# EAGLE design RK (EAGLE 7.2.0)
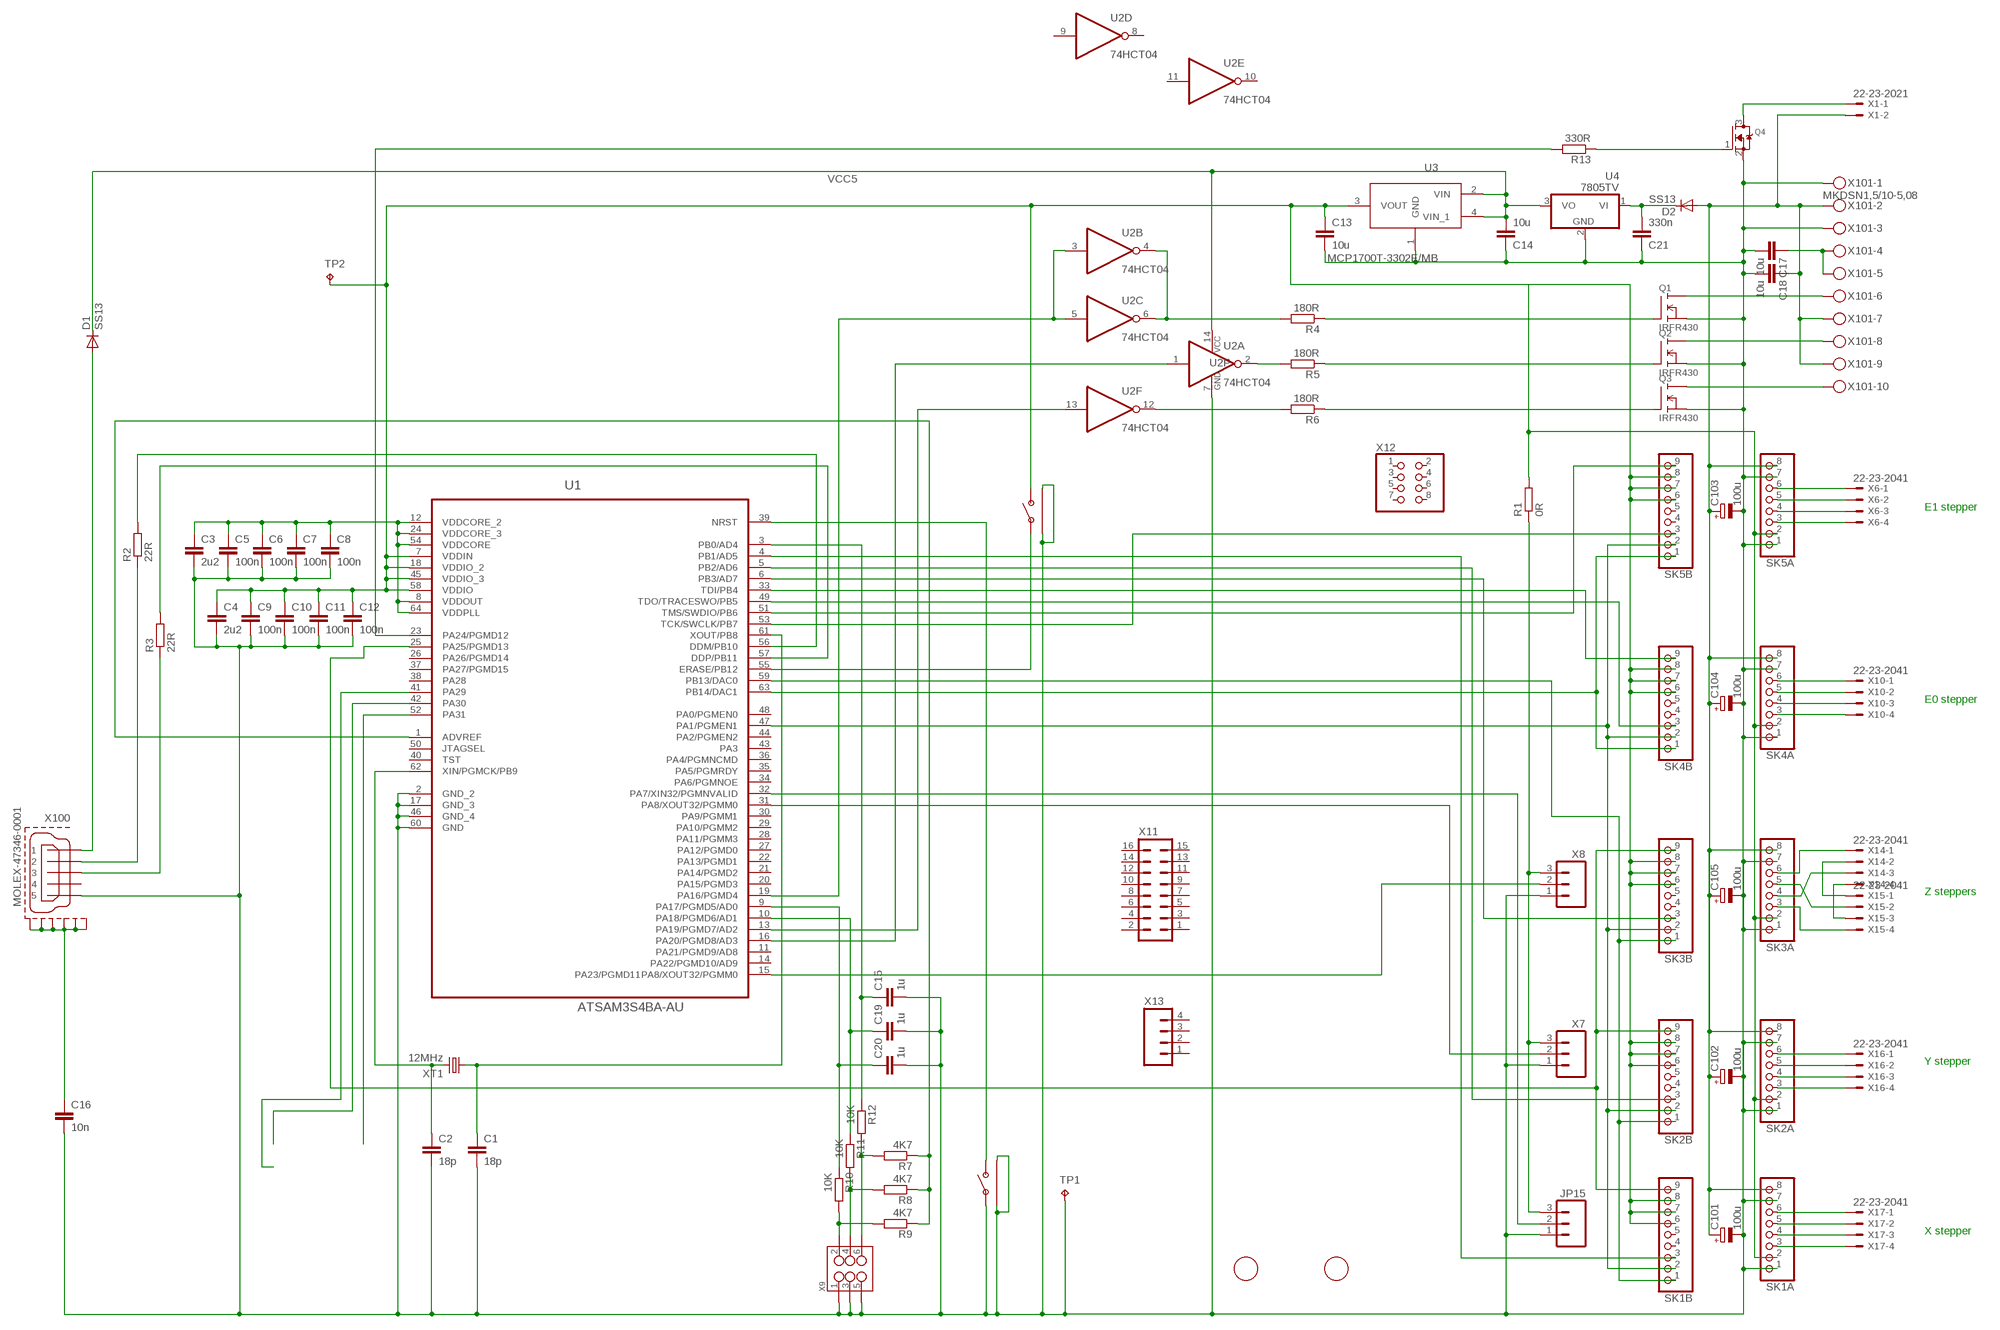
[diagram p0: schematic, sheet 1]

## Parts
C1  18p  C-EUC0603  [C0603]
C2  18p  C-EUC0603  [C0603]
C3  2u2  C-EUC0603  [C0603]
C4  2u2  C-EUC0603  [C0603]
C5  100n  C-EUC0603  [C0603]
C6  100n  C-EUC0603  [C0603]
C7  100n  C-EUC0603  [C0603]
C8  100n  C-EUC0603  [C0603]
C9  100n  C-EUC0603  [C0603]
C10  100n  C-EUC0603  [C0603]
C11  100n  C-EUC0603  [C0603]
C12  100n  C-EUC0603  [C0603]
C13  10u  C-EUC0805  [C0805]
C14  10u  C-EUC0805  [C0805]
C15  1u  C-EUC0603  [C0603]
C16  10n  C-EUC0603  [C0603]
C17  10u  C-EUC0805K  [C0805K]
C18  10u  C-EUC0805K  [C0805K]
C19  1u  C-EUC0603  [C0603]
C20  1u  C-EUC0603  [C0603]
C21  330n  C-EUC0805  [C0805]
C101  100u  CPOL-EUD  [PANASONIC_D]
C102  100u  CPOL-EUD  [PANASONIC_D]
C103  100u  CPOL-EUD  [PANASONIC_D]
C104  100u  CPOL-EUD  [PANASONIC_D]
C105  100u  CPOL-EUD  [PANASONIC_D]
D1  SS13  DIODE-DO214AC  [DO214AC]
D2  SS13  DIODE-DO214AC  [DO214AC]
JP15  M03PTH  [1X03]
Q1  IRFR430  [DPAK]
Q2  IRFR430  [DPAK]
Q3  IRFR430  [DPAK]
Q4  MOSFET-NREFLOW  [SOT23]
R1  0R  R-EU_R0603  [R0603]
R2  22R  R-EU_R0603  [R0603]
R3  22R  R-EU_R0603  [R0603]
R4  180R  R-EU_R0603  [R0603]
R5  180R  R-EU_R0603  [R0603]
R6  180R  R-EU_R0603  [R0603]
R7  4K7  R-EU_R0603  [R0603]
R8  4K7  R-EU_R0603  [R0603]
R9  4K7  R-EU_R0603  [R0603]
R10  10K  R-EU_R0603  [R0603]
R11  10K  R-EU_R0603  [R0603]
R12  10K  R-EU_R0603  [R0603]
R13  330R  R-EU_R0603  [R0603]
SK1A  PINHD-1X8BIG  [1X08-BIG]
SK1B  PINHD-1X9  [1X09-BIG]
SK2A  PINHD-1X8BIG  [1X08-BIG]
SK2B  PINHD-1X9  [1X09-BIG]
SK3A  PINHD-1X8BIG  [1X08-BIG]
SK3B  PINHD-1X9  [1X09-BIG]
SK4A  PINHD-1X8BIG  [1X08-BIG]
SK4B  PINHD-1X9  [1X09-BIG]
SK5A  PINHD-1X8BIG  [1X08-BIG]
SK5B  PINHD-1X9  [1X09-BIG]
TP1  TPPAD1-10  [P1-10]
TP2  TPPAD1-10  [P1-10]
U1  ATSAM3S4BA-AU  [QFP50P1200X1200X160-64N]
U2  74HCT04  7404  [TSSOP14]
U3  MCP1700T-3302E/MB  MCP17-MCP1702T-3302E/MB  [SOT150P400X160-4N]
U4  7805TV  [TO220V]
U$1  FIDUCIAL  [FIDUCIAL_1MM]
U$2  FIDUCIAL  [FIDUCIAL_1MM]
U$3  ALPS-SKHHLUA010  [SKHHLUA010]
U$4  ALPS-SKHHLUA010  [SKHHLUA010]
X1  22-23-2021  [22-23-2021]
X6  22-23-2041  [22-23-2041]
X7  M03PTH  [1X03]
X8  M03PTH  [1X03]
X9  M03X22X3_SILK_SM  [2X3]
X10  22-23-2041  [22-23-2041]
X11  MA08-2  [MA08-2]
X12  PINHD-2X4  [2X04]
X13  M04PTH  [1X04]
X14  22-23-2041  [22-23-2041]
X15  22-23-2041  [22-23-2041]
X16  22-23-2041  [22-23-2041]
X17  22-23-2041  [22-23-2041]
X100  MOLEX-47346-0001  [MOLEX-47364-0001]
X101  MKDSN1,5/10-5,08  [MKDSN1,5/10-5,08]
XT1  12MHz  CRYSTALHC49U-V  [HC49U-V]

## Nets
BED-VE: Q1.2(D) X101.6
GND: C1.2 C2.2 C3.2 C4.2 C5.2 C6.2 C7.2 C8.2 C9.2 C10.2 C11.2 C12.2 C13.2 C14.1 C15.2 C16.2 C17.2 C18.2 C19.2 C20.2 C21.1 C101.- C102.- C103.- C104.- C105.- JP15.1 Q1.3(S) Q2.3(S) Q3.3(S) Q4.2(S) SK1A.1 SK1A.7 SK2A.1 SK2A.7 SK3A.1 SK3A.7 SK4A.1 SK4A.7 SK5A.1 SK5A.7 TP1.TP U1.2(GND_2) U1.17(GND_3) U1.46(GND_4) U1.60(GND) U2.7(P:GND) U3.1(GND) U4.2(GND) U$3.P$1 U$3.P$3 U$3.P$4 U$4.P$3 U$4.P$4 X7.1 X8.1 X9.1 X9.3 X9.5 X100.5 X101.1 X101.3
HEATER1-VE: Q2.2(D) X101.8
HEATER2-VE: Q3.2(D) X101.10
N$1: SK1B.2 SK2B.2 SK3B.2 SK4B.2 SK5B.2 U1.47(PA1/PGMEN1)
N$2: SK4A.3 X10.4
N$3: SK4A.4 X10.3
N$4: SK4A.5 X10.2
N$5: SK4A.6 X10.1
N$6: SK1A.3 X17.4
N$7: SK1A.4 X17.3
N$8: SK1A.5 X17.2
N$9: SK1A.6 X17.1
N$10: SK3A.6 X14.1
N$11: SK3A.4 X14.3
N$12: SK3A.3 X15.4
N$13: X14.2 X15.1
N$14: X14.4 X15.3
N$15: SK3A.5 X15.2
N$16: C18.1 C101.+ C102.+ C103.+ C104.+ C105.+ D2.A SK1A.8 SK2A.8 SK3A.8 SK4A.8 SK5A.8 X1.2 X101.2 X101.7 X101.9
N$17: SK5A.3 X6.4
N$18: R2.2 U1.56(DDM/PB10)
N$19: SK5A.4 X6.3
N$20: SK5A.5 X6.2
N$21: C1.1 U1.61(XOUT/PB8) XT1.1
N$22: C2.1 U1.62(XIN/PGMCK/PB9) XT1.2
N$23: U1.55(ERASE/PB12) U$4.P$1
N$24: U1.41(PA29)
N$25: U1.39(NRST) U$3.P$2
N$26: SK1B.3 U1.4(PB1/AD5)
N$27: C20.1 R10.1 U1.9(PA17/PGMD5/AD0)
N$28: R3.2 U1.57(DDP/PB11)
N$29: U1.19(PA16/PGMD4) U2.3(B:I) U2.5(C:I)
N$30: U1.13(PA19/PGMD7/AD2) U2.13(F:I)
N$31: D1.A X100.1
N$32: R2.1 X100.2
N$33: R7.2 R12.2 X9.6
N$34: R3.1 X100.3
N$35: R13.2 U1.23(PA24/PGMD12)
N$36: SK5A.6 X6.1
N$37: SK2A.3 X16.4
N$38: SK2A.4 X16.3
N$39: SK2A.5 X16.2
N$40: SK1B.9 SK2B.9 SK3B.9 U1.25(PA25/PGMD13)
N$41: U1.42(PA30)
N$42: U1.52(PA31)
N$43: SK2A.6 X16.1
N$44: SK5B.3 U1.53(TCK/SWCLK/PB7)
N$45: JP15.3 R1.1 X7.3 X8.3
N$47: C16.1 X100.GND1 X100.GND2 X100.GND3 X100.GND4 X100.GND5 X100.GND6
N$48: SK4B.9 U1.33(TDI/PB4)
N$49: C17.1 X101.4 X101.5
N$50: C19.1 R11.1 U1.10(PA18/PGMD6/AD1)
N$51: SK4B.1 SK5B.1 U1.63(PB14/DAC1)
N$52: SK1B.1 SK2B.1 SK3B.1 U1.59(PB13/DAC0)
N$53: R7.1 R8.1 R9.1 U1.1(ADVREF)
N$54: SK4B.3 U1.49(TDO/TRACESWO/PB5)
N$55: R8.2 R11.2 X9.4
N$56: SK5B.9 U1.51(TMS/SWDIO/PB6)
N$57: SK3B.3 U1.6(PB3/AD7)
N$58: SK2B.3 U1.5(PB2/AD6)
N$59: U1.15(PA23/PGMD11PA8/XOUT32/PGMM0) X8.2
N$60: Q4.3(D) X1.1
N$62: U1.31(PA8/XOUT32/PGMM0) X7.2
N$63: Q4.1(G) R13.1
N$65: Q1.1(G) R4.1
N$66: Q2.1(G) R5.1
N$67: Q3.1(G) R6.1
N$68: R9.2 R10.2 X9.2
N$69: C15.1 R12.1 U1.3(PB0/AD4)
N$70: U1.16(PA20/PGMD8/AD3) U2.1(A:I)
N$71: R6.2 U2.12(F:O)
N$72: R4.2 U2.4(B:O) U2.6(C:O)
N$73: R5.2 U2.2(A:O)
N$78: C21.2 D2.C U4.1(VI)
VCC: C4.1 C9.1 C10.1 C11.1 C12.1 C13.1 R1.2 SK1A.2 SK1B.6 SK1B.7 SK1B.8 SK2A.2 SK2B.6 SK2B.7 SK2B.8 SK3A.2 SK3B.6 SK3B.7 SK3B.8 SK4A.2 SK4B.6 SK4B.7 SK4B.8 SK5A.2 SK5B.6 SK5B.7 SK5B.8 TP2.TP U1.7(VDDIN) U1.18(VDDIO_2) U1.45(VDDIO_3) U1.58(VDDIO) U3.3(VOUT) U$4.P$2
VCC5: C14.2 D1.C U2.14(P:VCC) U3.2(VIN) U3.4(VIN_1) U4.3(VO)
VDDCORE: C3.1 C5.1 C6.1 C7.1 C8.1 U1.8(VDDOUT) U1.12(VDDCORE_2) U1.24(VDDCORE_3) U1.54(VDDCORE) U1.64(VDDPLL)
X6: JP15.2 U1.32(PA7/XIN32/PGMNVALID)
Unconnected: SK1B.4 SK1B.5 SK2B.4 SK2B.5 SK3B.4 SK3B.5 SK4B.4 SK4B.5 SK5B.4 SK5B.5 U1.11(PA21/PGMD9/AD8) U1.14(PA22/PGMD10/AD9) U1.20(PA15/PGMD3) U1.21(PA14/PGMD2) U1.22(PA13/PGMD1) U1.26(PA26/PGMD14) U1.27(PA12/PGMD0) U1.28(PA11/PGMM3) U1.29(PA10/PGMM2) U1.30(PA9/PGMM1) U1.34(PA6/PGMNOE) U1.35(PA5/PGMRDY) U1.36(PA4/PGMNCMD) U1.37(PA27/PGMD15) U1.38(PA28) U1.40(TST) U1.43(PA3) U1.44(PA2/PGMEN2) U1.48(PA0/PGMEN0) U1.50(JTAGSEL) U2.8(D:O) U2.9(D:I) U2.10(E:O) U2.11(E:I) X11.1 X11.2 X11.3 X11.4 X11.5 X11.6 X11.7 X11.8 X11.9 X11.10 X11.11 X11.12 X11.13 X11.14 X11.15 X11.16 X12.1 X12.2 X12.3 X12.4 X12.5 X12.6 X12.7 X12.8 X13.1 X13.2 X13.3 X13.4 X100.4

## Notes on the sheet
- E1 stepper
- E0 stepper
- Z steppers
- Y stepper
- X stepper

## Library data of the parts
C1-C21 = resistor:C-EU: CAPACITOR, European symbol
C101-C105 = resistor:CPOL-EU: POLARIZED CAPACITOR, European symbol
D1 D2 = diode:DIODE-: DIODE
JP15 X7 X8 = SparkFun-Connectors:M03: Header 3 Standard 3-pin 0.1" header. Use with straight break away headers (SKU : PRT-00116), right angle break away headers (PRT-00553), swiss pins (PRT-00743), machine pins (PRT-00117), and female headers (PRT-00115). Molex polarized connector foot print use with SKU : PRT-08232 with associated crimp pins and housings.
Q1-Q3 = transistor-fet:IRFR430: N-Channel HEXFET
Q4 = adafruit:MOSFET-N: N-Channel Mosfet 2N7002E - 60V 260mA SOT23 [Digikey: 2N7002ET1GOSTR-ND] - REEL BSH103 - 30V 850mA SOT23 [Digikey: 568-5013-1-ND]
R1-R13 = resistor:R-EU_: RESISTOR, European symbol
SK1A SK2A SK3A SK4A SK5A = adafruit:PINHD-1X8: PIN HEADER
SK1B SK2B SK3B SK4B SK5B = adafruit:PINHD-1X9: Pin header 1x10 0.1" spacing With round pins
TP1 TP2 = testpad:TP: Test pad
U1 = Atmel_By_element14_Batch_1:ATSAM3S4BA-AU: Flash MCU; DESCRIPTION: Flash MCU; MPN: ATSAM3S4BA-AU; OC_FARNELL: 1841656; OC_NEWARK: 12T1314; PACKAGE: QFP-64; SUPPLIER: Atmel
U2 = eschertechnologies:74*04: Hex INVERTER
U3 = Microchip-MCP170xxxx_MB:MCP17: Low Quiescent Current LDO Regulator; MPN: MCP1702T-3302E/MB; OC_FARNELL: 1605558; OC_NEWARK: 11N7989; PACKAGE: SOT89-3; SUPPLIER: Microchip
U4 = linear:78*: Positive VOLTAGE REGULATOR Source: http://cache.national.com/ds/LM/LM78L05.pdf http://www.fairchildsemi.com/ds/LM/LM7805.pdf
U$1 U$2 = adafruit:FIDUCIAL: For use by pick and place machines to calibrate the vision/machine, 1mm By microbuilder.eu
U$3 U$4 = eschertechnologies:ALPS-SKHHLUA010
X1 = con-molex:22-23-2021: .100" (2.54mm) Center Header - 2 Pin; MF: MOLEX; MPN: 22-23-2021; OC_FARNELL: 1462926; OC_NEWARK: 25C3832
X6 X10 X14-X17 = con-molex:22-23-2041: .100" (2.54mm) Center Header - 4 Pin; MF: MOLEX; MPN: 22-23-2041; OC_FARNELL: 1462920; OC_NEWARK: 38C0355
X9 = SparkFun-Connectors:M03X2: 2x3 .1" header. Shrouded, with keying- CONN-10681 SMT- CONN-11415 Pogo pins- HW-11044
X11 = con-lstb:MA08-2: PIN HEADER; OC_FARNELL: unknown; OC_NEWARK: unknown
X12 = adafruit:PINHD-2X4: PIN HEADER
X13 = SparkFun-Connectors:M04: Header 4 Standard 4-pin 0.1" header. Use with straight break away headers (SKU : PRT-00116), right angle break away headers (PRT-00553), swiss pins (PRT-00743), machine pins (PRT-00117), and female headers (PRT-00115). Molex polarized connector foot print use with SKU : PRT-08231 with associated crimp pins and housings. 1MM SMD Version SKU: PRT-10208
X100 = usb_con-update:MOLEX-47346-0001: MICRO USB B, BOTTOM MOUNT
X101 = con-phoenix-508:MKDSN1,5/10-5,08: MKDSN 1,5/10-5,08 Printklemme Nennstrom: 13,5 A Nennspannung: 250 V Rastermaß: 5,08 mm Polzahl: 10 Anschlussart: Schraubanschluss Montage: Löten Anschlussrichtung Leiter/Platine: 0 ° Artikelnummer: 1729209 Source: http://eshop.phoenixcontact.com .. 1729209.pdf; MPN: SMKDSN1,5/10-5,08; OC_FARNELL: 1792913; OC_NEWARK: 70R0297
XT1 = crystal:CRYSTAL: CRYSTAL; OC_FARNELL: 1666969; OC_NEWARK: unknown

## Board
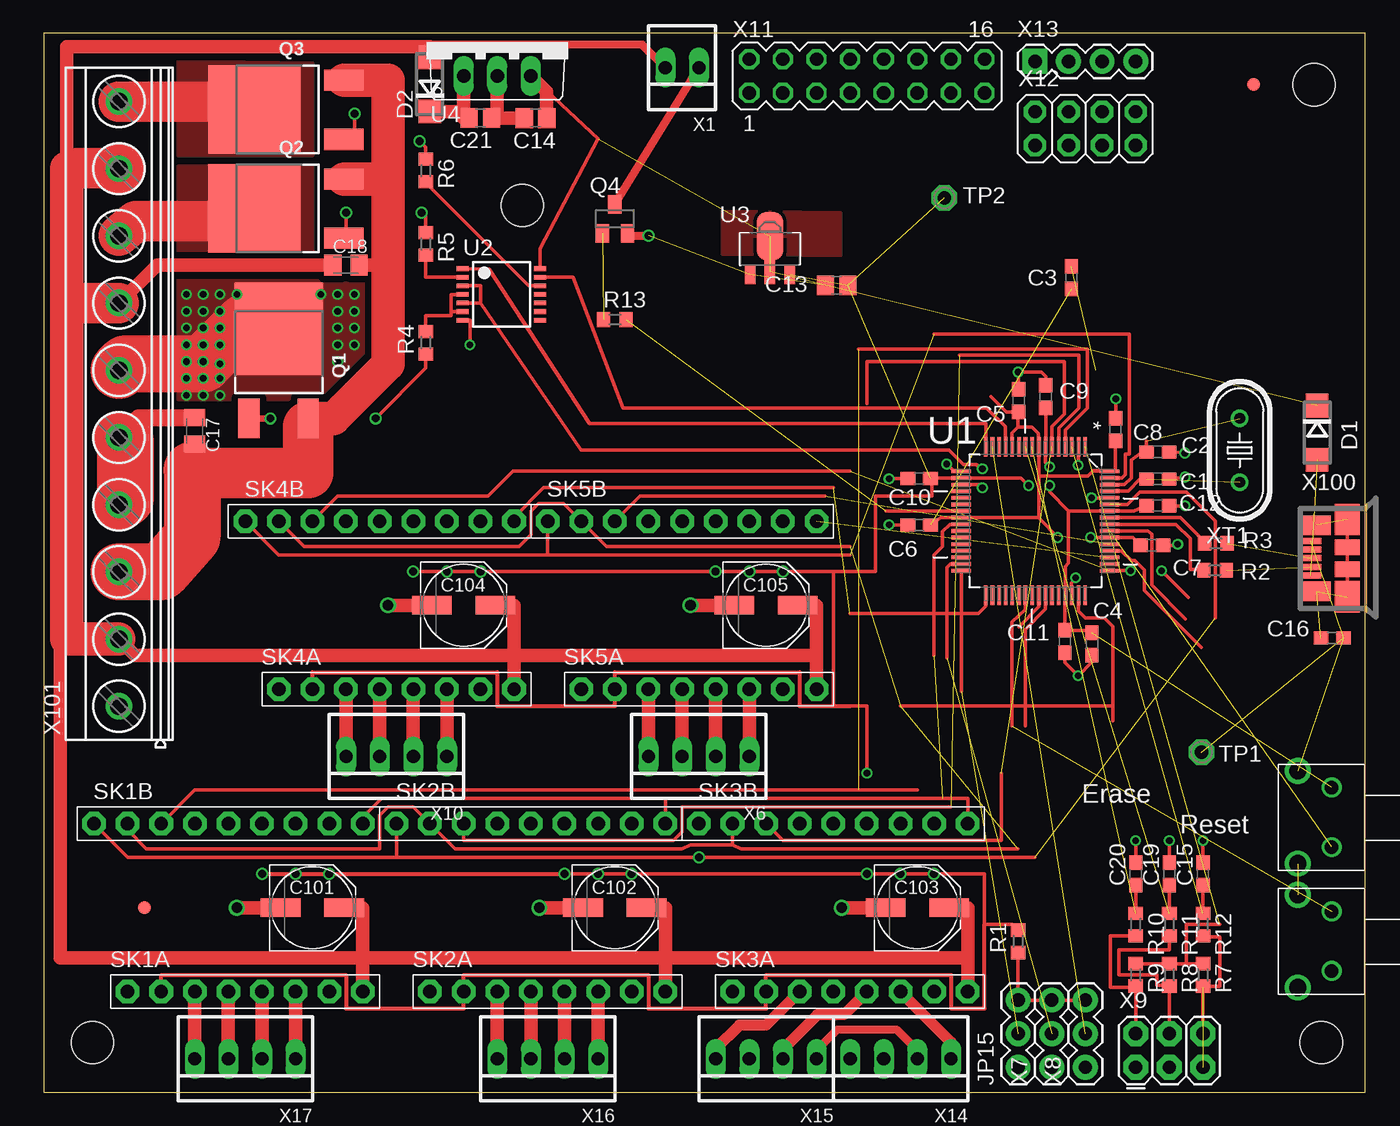
[diagram p1: board, top side]
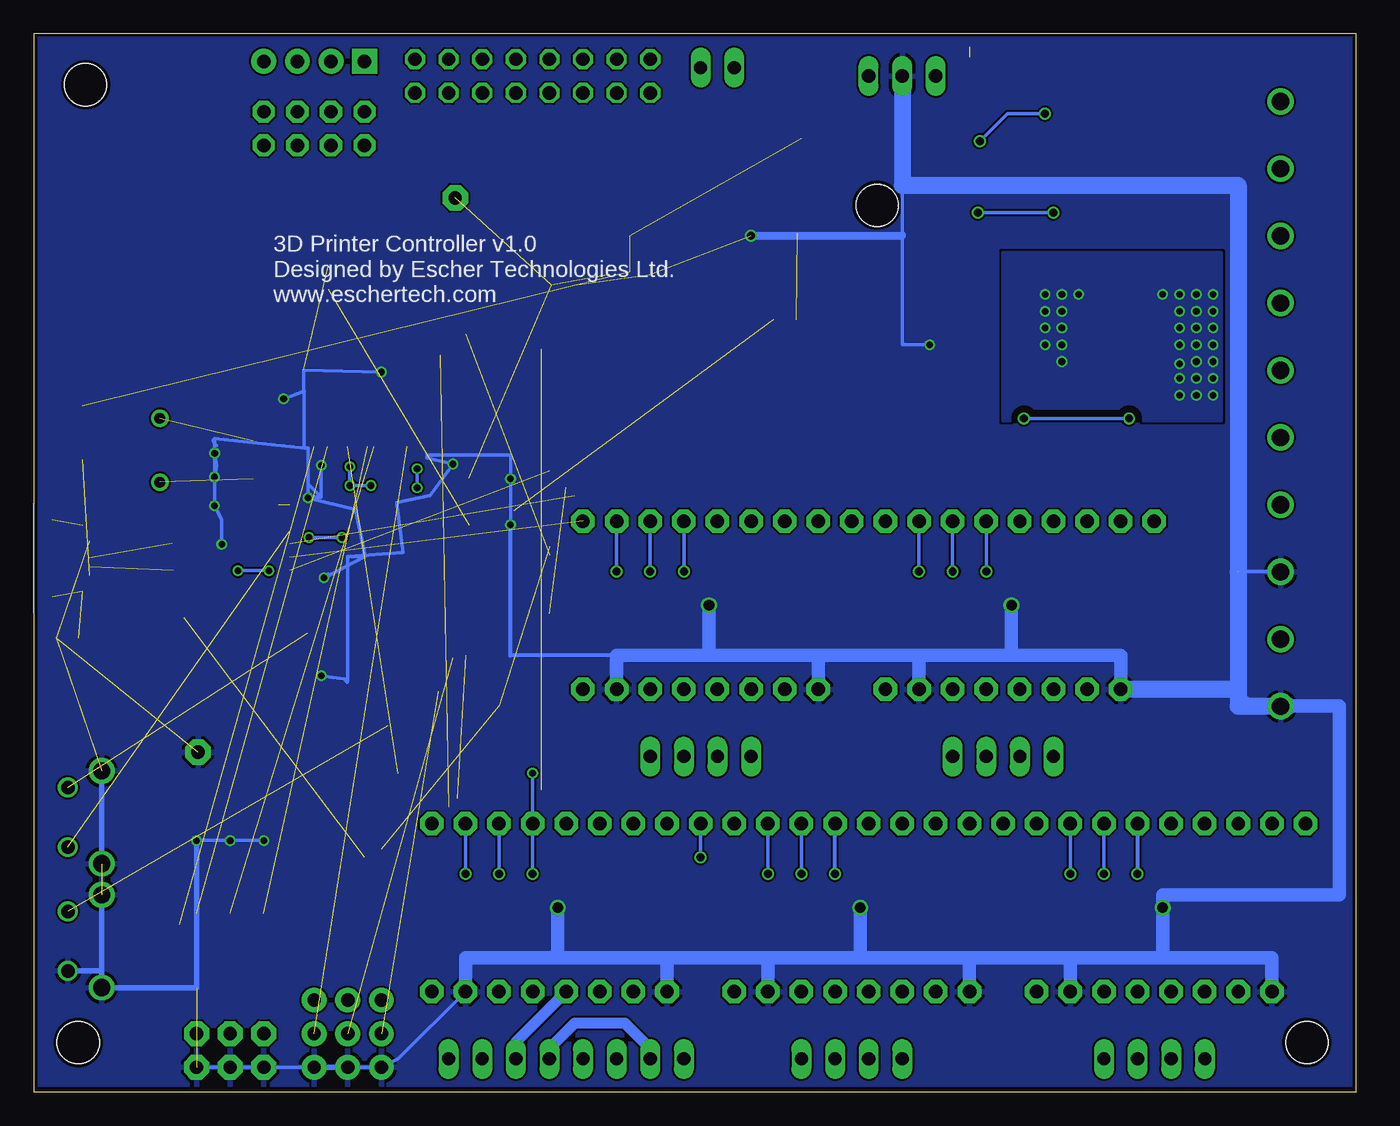
[diagram p2: board, bottom side, seen from below]

Size 99.9 x 80.08 mm. Coordinates in mm from the lower left corner, seen from the top.
Outline: 0,0 99.9,0 99.9,80.08 0,80.08 0,0
Copper layers (1*16): Top 0.035mm / dielectric 1.5mm / Bottom 0.035mm
Design rules "ITEADstudio_DRC": minimum track width 6mil, minimum drill 12mil, track to track 6mil, track to pad 6mil, pad to pad 6mil, via to via 6mil, smd to smd 0mil, copper to edge 10mil, drill to drill 10mil, minimum pad ring 10mil, minimum via ring 6mil, stop-mask expansion 2mil, vias tented up to drill 100mil, thermal gap 10mil
Holes 3.2 mm at 3.7,3.78 36.19,67.06 96.02,76.18 96.57,3.78

### Footprints (pad centres in the part's own frame; a part is rotated, then mirrored left to right if it is on the bottom)
C0603 = smd 1.1 x 1: 1 -0.85,0; 2 0.85,0
C0805 = smd 1.3 x 1.5: 1 -0.85,0; 2 0.85,0
C0805K = smd 1.3 x 1.6: 1 -1,0; 2 1,0
PANASONIC_D = smd 3 x 1.4: + 2.4,0; - -2.4,0
DO214AC = smd 1.8 x 1.7: A 2.05,0; C -2.05,0
1X03 = drill 1.016 pad 1.88: 1 0,0; 2 2.54,0; 3 5.08,0
DPAK = smd 1.6 x 2.997: 1 -2.261,-4.928; 3 2.21,-4.928 | smd 6.7 x 7: 2 0,1.853
SOT23 = smd 1 x 1.4: 1 -0.95,-1.1; 2 0.95,-1.1; 3 0,1.1
R0603 = smd 1 x 1.1: 1 -0.85,0; 2 0.85,0
1X08-BIG = drill 1.016 pad 1.778 octagon: 1 -8.89,0; 2 -6.35,0; 3 -3.81,0; 4 -1.27,0; 5 1.27,0; 6 3.81,0; 7 6.35,0; 8 8.89,0
1X09-BIG = drill 1.016 pad 1.778 octagon: 1 -10.16,0; 2 -7.62,0; 3 -5.08,0; 4 -2.54,0; 5 0,0; 6 2.54,0; 7 5.08,0; 8 7.62,0; 9 10.16,0
P1-10 = drill 1 pad 1.93 octagon: TP 0,0
QFP50P1200X1200X160-64N = smd 1.473 x 0.279: 1 -5.613,3.759; 2 -5.613,3.251; 3 -5.613,2.743; 4 -5.613,2.261; 5 -5.613,1.753; 6 -5.613,1.245; 7 -5.613,0.762; 8 -5.613,0.254; 9 -5.613,-0.254; 10 -5.613,-0.762; 11 -5.613,-1.245; 12 -5.613,-1.753; 13 -5.613,-2.261; 14 -5.613,-2.743; 15 -5.613,-3.251; 16 -5.613,-3.759; 33 5.613,-3.759; 34 5.613,-3.251; 35 5.613,-2.743; 36 5.613,-2.261; 37 5.613,-1.753; 38 5.613,-1.245; 39 5.613,-0.762; 40 5.613,-0.254; 41 5.613,0.254; 42 5.613,0.762; 43 5.613,1.245; 44 5.613,1.753; 45 5.613,2.261; 46 5.613,2.743; 47 5.613,3.251; 48 5.613,3.759 | smd 0.279 x 1.473: 17 -3.759,-5.613; 18 -3.251,-5.613; 19 -2.743,-5.613; 20 -2.261,-5.613; 21 -1.753,-5.613; 22 -1.245,-5.613; 23 -0.762,-5.613; 24 -0.254,-5.613; 25 0.254,-5.613; 26 0.762,-5.613; 27 1.245,-5.613; 28 1.753,-5.613; 29 2.261,-5.613; 30 2.743,-5.613; 31 3.251,-5.613; 32 3.759,-5.613; 49 3.759,5.613; 50 3.251,5.613; 51 2.743,5.613; 52 2.261,5.613; 53 1.753,5.613; 54 1.245,5.613; 55 0.762,5.613; 56 0.254,5.613; 57 -0.254,5.613; 58 -0.762,5.613; 59 -1.245,5.613; 60 -1.753,5.613; 61 -2.261,5.613; 62 -2.743,5.613; 63 -3.251,5.613; 64 -3.759,5.613
TSSOP14 = smd 0.35 x 0.9: 1 -1.95,-2.925; 2 -1.3,-2.925; 3 -0.65,-2.925; 4 0,-2.925; 5 0.65,-2.925; 6 1.3,-2.925; 7 1.95,-2.925; 8 1.95,2.925; 9 1.3,2.925; 10 0.65,2.925; 11 0,2.925; 12 -0.65,2.925; 13 -1.3,2.925; 14 -1.95,2.925
SOT150P400X160-4N = smd 0.8 x 1.4: 1 -1.499,-1.981; 3 1.499,-1.981 | smd 0.8 x 1.9: 2 0,-1.727 | smd 2.032 x 3.65: 4 0,0.94
TO220V = drill 1.016 long: 1 -2.54,-2.54; 2 0,-2.54; 3 2.54,-2.54
FIDUCIAL_1MM = smd 1 x 1: 1 0,0
SKHHLUA010 = drill 1: P$1 2.5,2.25; P$2 2.5,-2.25 | drill 1.3: P$3 5.05,3.5; P$4 5.05,-3.5
22-23-2021 = drill 1 long: 1 -1.27,0; 2 1.27,0
22-23-2041 = drill 1 long: 1 -3.81,0; 2 -1.27,0; 3 1.27,0; 4 3.81,0
2X3 = drill 1.016 pad 1.88 octagon: 1 0,0; 2 0,2.54; 3 2.54,0; 4 2.54,2.54; 5 5.08,0; 6 5.08,2.54
MA08-2 = drill 1.016 octagon: 1 -8.89,-1.27; 2 -8.89,1.27; 3 -6.35,-1.27; 4 -6.35,1.27; 5 -3.81,-1.27; 6 -3.81,1.27; 7 -1.27,-1.27; 8 -1.27,1.27; 9 1.27,-1.27; 10 1.27,1.27; 11 3.81,-1.27; 12 3.81,1.27; 13 6.35,-1.27; 14 6.35,1.27; 15 8.89,-1.27; 16 8.89,1.27
2X04 = drill 1.016 pad 1.676 octagon: 1 -3.81,-1.27; 2 -3.81,1.27; 3 -1.27,-1.27; 4 -1.27,1.27; 5 1.27,-1.27; 6 1.27,1.27; 7 3.81,-1.27; 8 3.81,1.27
1X04 = drill 1.016 pad 1.88 square: 1 0,0 | drill 1.016 pad 1.88: 2 2.54,0; 3 5.08,0; 4 7.62,0
MOLEX-47364-0001 = smd 1.7 x 0.45: 1 2.8,1.3; 2 2.8,0.65; 3 2.8,0; 4 2.8,-0.65; 5 2.8,-1.3 | smd 1.9 x 2.375: GND1 0,2.925; GND4 0,-2.925 | smd 2.1 x 1.475: GND2 2.3,2.5; GND3 2.3,-2.5 | smd 1.9 x 1.175: GND5 0,-0.84; GND6 0,0.835
MKDSN1,5/10-5,08 = drill 1.3 pad 2: 1 -22.881,0.025; 2 -17.801,0.025; 3 -12.721,0.025; 4 -7.641,0.025; 5 -2.561,0.025; 6 2.519,0.025; 7 7.599,0.025; 8 12.679,0.025; 9 17.759,0.025; 10 22.839,0.025
HC49U-V = drill 0.813: 1 -2.413,0; 2 2.413,0

### Placement (x,y rotation side)
C1  84.22,46.38 0 top
C2  84.22,48.41 0 top
C3  77.69,61.59 90 top
C4  79.24,33.89 270 top
C5  73.7,52.29 90 top
C6  66.18,42.9 180 top
C7  83.76,41.36 0 top
C8  81.02,50.12 90 top
C9  75.74,52.59 90 top
C10  66.18,46.41 180 top
C11  77.19,34.09 270 top
C12  84.21,44.35 0 top
C13  59.95,61.01 180 top
C14  37.18,73.66 0 top
C15  87.63,16.51 90 top
C16  97.39,34.35 0 top
C17  11.43,50.01 270 top
C18  22.86,62.55 0 top
C19  85.09,16.51 90 top
C20  82.55,16.51 90 top
C21  33.02,73.66 180 top
C101  20.32,13.97 0 top
C102  43.18,13.97 0 top
C103  66.04,13.97 0 top
C104  31.75,36.83 0 top
C105  54.61,36.83 0 top
D1  96.25,49.88 270 top
D2  29.21,76.2 90 top
JP15  73.66,1.91 90 top
Q1  17.78,55.88 0 top
Q2  17.78,66.83 90 top
Q3  17.78,74.3 90 top
Q4  43.18,66.04 0 top
R1  73.66,11.43 90 top
R2  88.54,39.47 180 top
R3  88.6,41.51 180 top
R4  28.89,56.67 90 top
R5  28.89,64.14 270 top
R6  28.89,69.69 270 top
R7  87.63,8.89 270 top
R8  85.09,8.89 270 top
R9  82.55,8.89 270 top
R10  82.55,12.7 270 top
R11  85.09,12.7 270 top
R12  87.63,12.7 270 top
R13  43.18,58.42 0 top
SK1A  15.24,7.62 0 top
SK1B  13.97,20.32 0 top
SK2A  38.1,7.62 0 top
SK2B  36.83,20.32 0 top
SK3A  60.96,7.62 0 top
SK3B  59.69,20.32 0 top
SK4A  26.67,30.48 0 top
SK4B  25.4,43.18 0 top
SK5A  49.53,30.48 0 top
SK5B  48.26,43.18 0 top
TP1  87.52,25.72 0 top
TP2  68.08,67.62 0 top
U1  74.97,43.2 270 top
U2  34.61,60.33 270 top
U3  54.9,63.79 0 top
U4  34.29,79.38 0 top
U$1  91.44,76.2 0 top
U$2  7.62,13.97 0 top
U$3  99.85,11.43 180 top
U$4  99.85,20.8 180 top
X1  48.26,77.47 180 top
X6  49.53,25.4 180 top
X7  76.2,1.91 90 top
X8  78.74,1.91 90 top
X9  82.55,1.91 0 top
X10  26.67,25.4 180 top
X11  62.23,76.83 0 top
X12  78.74,72.87 0 top
X13  74.93,77.95 0 top
X14  64.77,2.54 180 top
X15  54.61,2.54 180 top
X16  38.1,2.54 180 top
X17  15.24,2.54 180 top
X100  98.53,40.38 180 top
X101  5.71,52.07 90 top
XT1  90.41,48.55 90 top

### Tracks (layer width: path | path; a pad name or v marks a point on that pad's centre or on a via)
BED-VE  (via drill 0.5)
  Top 0.254: 14.76,58.58 18.26,58.58 17.78,58.1 Q1.2 | Q1.2 17.78,58.26 17.78,58.42 | Q1.2 17.78,57.15 17.3,56.67 17.3,56.2 | v12.06,56.52 v12.06,55.24
  Top 3.81: 15.24,58.26 17.78,58.26
  Top 4.318: X101.6 6.19,55.09 12.06,55.09 15.24,58.26
  other vias: 12.06,53.98 10.79,56.52 10.79,55.24 10.79,53.98 12.06,57.78 13.34,53.98 13.34,55.09 13.34,56.52 13.34,57.78 13.34,59.05 13.34,60.33 23.5,60.33 23.5,59.05 23.5,56.52 23.5,57.78 22.23,56.52 22.23,57.78 22.23,59.05 22.23,60.33 20.95,60.33 14.61,60.33 22.23,55.24 10.79,52.7 12.06,52.7 13.34,52.7 10.79,57.78 10.79,59.05 10.79,60.33 12.06,60.33 12.06,59.05
  pour Top (isolate 0.508): 10.16,62.23 10.16,52.39 25.4,52.39 25.4,62.23
  pour Bottom (isolate 0.508, rank 2): 10.16,63.5 26.67,63.5 26.67,50.8 10.16,50.8
GND  (via drill 0.5, 0.5 pad 0.25, 0.6, 0.8)  (9 unrouted)
  Top 0.254: U1.2 78.2,48.81 v78.2,47.4 | 69.9,46.95 69.9,47 69.4,47 | U1.46 77.7,38.5 v78,38.9 | C1.2 85.37,46.44 85.88,46.44 v86.27,46.52 | U1.60 v79.2,44.95 | 75.7,53.04 C9.2 75.74,54.12 75.41,54.45 v73.66,54.45 73.7,53.38 C5.2 | C10.2 64.09,46.41 v63.9,46.4 | v63.9,42.9 C6.2 | 69.4,47 U1.17 | C11.2 77.19,32.5 v78.2,31.5 79.24,32.54 C4.2 | C2.2 85.38,48.41 v86.26,48.33 | 69.4,47 68.75,47 v68.25,47.5 | v81.05,52.42 81.05,51.27 C8.2 | U2.7 32.23,58.38 v32.23,56.52 | C17.2 11.56,48.87 11.23,47.04 11.72,46.83 | 26.05,69.04 26.04,68.1 | 26.04,62.55 26.04,62.23 | C20.2 v82.55,19.05 | v85.09,19.05 C19.2 | C15.2 v87.63,19.05 | C7.2 85.65,41.36 v85.72,41.43 | v86.28,44.35 C12.2
  Top 0.61: Q4.2 44.3,64.77 v45.72,64.77
  Top 1.016: C105.- v48.9,36.83 | C104.- v26.04,36.83 | C101.- v14.61,13.97 | C102.- v37.47,13.97 | C103.- v60.33,13.97 | C18.2 26.04,62.55 | C21.1 34.29,73.66 | 34.29,73.66 U4.2 | 34.29,73.66 C14.1
  Top 2.54: Q3.3 26.02,76.5 26.04,74.3 26.04,68.1 26.04,62.23 26.04,55.08 21.91,50.95 Q1.3 | Q2.3 26.05,69.04 | 19.99,50.33 Q1.3 | Q1.3 19.99,50.32
  Top 3.81: 11.72,46.83 20,46.83 19.99,50.33
  Top 4.318: 11.23,47.04 11.23,41.98 8.89,39.35 X101.3
  Bottom 0.254: 74.9,40.5 76.2,40.5 | 76.2,40.5 72,40.8 72.5,44.6 69.96,45.13 v68.25,47.5 70.2,47.95 70.2,48.2 63.9,48.2 v63.9,46.4 v63.9,42.9 | 79.2,46 79.2,45 | 79.2,45 v79.2,44.95 75.6,44.05 74.9,40.5 | 79.2,45 78.2,45 | 77.7,39.2 v78,38.9 74.9,40.5 | v86.27,46.52 v86.28,44.35 85.72,43.32 v85.72,41.43 | v86.27,46.52 v86.26,48.33 | 79.5,48.7 86.26,49.44 | 86.1,48.9 86.2,48.9 86.36,49.34 86.26,49.44 | v81.05,52.42 79.5,53 | 86.26,49.44 v86.26,48.33 | 79.5,48.7 79.2,48.7 79.2,46 | 79.5,48.7 79.5,53 | v78.2,31.5 76.48,31.25 | 76.48,31.25 76.2,31.1 76.2,40.5 | 76.24,31 76.48,31.25 | 79.2,46 78.2,45 | 78.2,45 v78.2,47.4 | v73.66,54.45 79.53,54.61 79.53,53.03 79.5,53 | 5.71,29.21 7.62,29.21 8.89,30.48 | 5.69,39.37 8.89,39.37 | X7.1 JP15.1 72.39,2.54 SK3A.7 | X9.5 X9.3 X9.1 X8.1 | v32.23,56.52 34.29,56.52 34.29,64.77 34.29,68.58 | v82.55,19.05 v85.09,19.05 v87.63,19.05 | v86.27,46.52 86.11,47.39 v86.26,48.33
  Bottom 0.305: 55.88,33.02 63.9,33.02 v63.9,42.9
  Bottom 0.406: X7.1 X8.1 | v87.63,19.05 87.63,7.93 U$3.P$3 94.8,9.18 | 94.8,9.18 U$3.P$4 | U$3.P$1 94.8,9.18 | U$4.P$3 U$4.P$4
  Bottom 0.61: v45.72,64.77 34.29,64.77
  Bottom 1.016: v48.9,36.83 48.9,33.02 | 48.9,33.02 55.88,33.02 SK5A.7 | 48.9,33.02 40.64,33.02 | 40.64,33.02 SK5A.1 | v26.04,36.83 26.04,33.18 25.88,33.02 | 25.88,33.02 17.78,33.02 SK4A.1 | 25.88,33.02 33.02,33.02 | SK4A.7 33.02,33.02 | 33.02,33.02 40.64,33.02 | 14.61,10.16 v14.61,13.97 14.61,14.92 1.27,14.92 1.27,29.21 5.08,29.21 5.69,29.21 X101.1 | 14.61,10.16 21.59,10.16 | v37.47,13.97 37.47,10.16 | 37.47,10.16 44.45,10.16 | 44.45,10.16 SK2A.7 | v60.33,13.97 60.33,10.16 | 60.33,10.16 67.31,10.16 SK3A.7 | 14.61,10.16 6.35,10.16 SK1A.1 | 37.47,10.16 29.21,10.16 | 29.21,10.16 SK2A.1 | 60.33,10.16 52.07,10.16 | 52.07,10.16 SK3A.1 | SK1A.7 21.59,10.16 | 21.59,10.16 29.21,10.16 | 44.45,10.16 52.07,10.16
  Bottom 1.27: U4.2 34.29,68.58 8.89,68.58 8.89,39.37 8.89,30.48 | 8.89,30.48 8.89,29.21 5.71,29.21 5.08,29.21 | 8.89,30.48 SK4A.1
  pour Bottom (rank 3): 0,80.01 99.69,80.01 99.69,0.64 0,0.64 0,1.27
HEATER1-VE
  Top 0.254: 15.91,66.02 Q2.2
  Top 3.048: X101.8 6.03,65.09 6.96,65.86 16.33,65.86 16.51,66.04 15.91,66.02
  pour Top (isolate 0.508): 10.16,70.01 20.32,70.01 20.32,63.5 10.16,63.5
HEATER2-VE
  Top 1.27: 13.41,74.91 Q3.2
  Top 3.048: X101.10 13.41,74.91
  pour Top (isolate 0.508): 10.16,77.95 10.16,70.8 20.32,70.8 20.32,77.79
N$1  (2 unrouted)
  Top 0.254: SK1B.2 6.35,19.84 7.77,18.41 25.4,18.41 25.4,20.95 26.04,21.59 27.94,21.59 SK2B.2 31.11,18.41 48.26,18.41 48.9,18.73 52.07,18.73 | 52.07,18.73 52.7,18.41 73.66,18.41 | SK4B.2 19.68,41.27 35.93,41.27 36.83,42.17 36.83,43.94 37.41,44.52 39.3,44.52 SK5B.2 42.55,41.27 60.96,41.27 | SK3B.2 52.07,18.73 | U1.47 78.22,36.4 78.74,35.88 80.17,35.88 80.8,35.24 80.8,29.21 | 80.8,28.1 80.8,29.21 | 80.8,29.21 64.77,29.21
N$2
  Top 1.016: SK4A.3 X10.4
N$3
  Top 1.016: SK4A.4 X10.3
N$4
  Top 1.016: SK4A.5 X10.2
N$5
  Top 1.016: SK4A.6 X10.1
N$6
  Top 1.016: SK1A.3 X17.4
N$7
  Top 1.016: SK1A.4 X17.3
N$8
  Top 1.016: SK1A.5 X17.2
N$9
  Top 1.016: SK1A.6 X17.1
N$10
  Top 0.813: SK3A.6 68.58,3.81 X14.1
N$11
  Bottom 0.813: SK3A.4 63.5,3.81 X14.3
N$12
  Top 0.813: SK3A.3 54.61,5.08 52.6,5.08 50.8,3.28 X15.4
N$13
  Top 0.61: X14.2 66.04,3.17 64.45,4.76 60.01,4.76 58.42,3.17 X15.1
N$14
  Bottom 0.813: X15.3 53.34,3.33 55.25,5.24 59.05,5.24 60.96,3.33 X14.4
N$15
  Top 0.813: SK3A.5 60.48,5.87 58.48,5.87 55.88,3.27 X15.2
N$16  (1 unrouted)
  Top 0.305: 29.21,79.22 29.21,79.06
  Top 0.406: 35.56,36.83 C104.+ | 58.42,36.83 C105.+ | 69.85,13.97 C103.+ | 46.99,13.97 C102.+ | 24.13,13.97 C101.+ | 2.54,36.83 1.75,34.27 | SK5A.8 58.42,33.02
  Top 0.61: X1.2 45.24,79.22 29.21,79.22
  Top 1.016: SK4A.8 35.56,33.02 | 35.56,33.02 35.56,36.83 | SK5A.8 58.42,36.83 | SK3A.8 69.85,10.16 | 69.85,10.16 69.85,13.97 | SK2A.8 46.99,10.16 | SK1A.8 24.13,10.16 | X101.2 6.94,33.02 35.56,33.02 | 24.13,10.16 46.99,10.16 | 46.99,13.97 46.99,10.16 | 46.99,10.16 69.85,10.16 | 24.13,13.97 24.13,10.16 | 24.13,10.16 1.27,10.16 1.27,34.29 1.29,34.27 1.75,34.27 | 58.42,33.02 35.56,33.02 | 29.21,79.06 1.75,79.06 1.75,69.85 | X101.7 8.57,62.55 C18.1
  Top 1.27: 2.56,59.67 1.75,62.23
  Top 2.54: X101.2 1.75,34.27 1.75,62.23 1.75,69.85 2.54,69.85
  Top 3.048: X101.7 2.56,59.67 | 5.67,69.85 2.54,69.85
  Top 3.81: X101.9 5.67,69.85
N$17
  Top 1.016: SK5A.3 X6.4
N$18
  Top 0.254: U1.56 85.59,42.95 86.68,41.86 86.68,39.53 87.37,39.53 R2.2
N$19
  Top 1.016: SK5A.4 X6.3
N$20
  Top 1.016: SK5A.5 X6.2
N$21  (1 unrouted)
  Top 0.254: 83.07,46.1 C1.1 83.35,46.35 82.87,46.35 81.97,45.46 U1.61
N$22  (1 unrouted)
  Top 0.254: U1.62 81.7,45.94 82.2,46.44 82.2,47.8 83.07,48.44 C2.1 83.37,49.24
N$23  (1 unrouted)
  Top 0.254: U1.55 83.46,42.44 83.75,42.2 83.75,38.34 | 83.75,38.34 83.76,38.34 | 83.75,38.34 86.3,35.8
N$24
  Top 0.254: U1.41 75.22,36.72 73.7,35.2
N$25  (1 unrouted)
  Top 0.254: U1.39 74.21,36.51 73.2,35.55 73.2,27.7 73.19,27.7
N$26  (1 unrouted)
  Top 0.254: SK1B.3 11.43,22.86 66.04,22.86 | U1.4 77.23,50.08 78.9,51.75 78.9,56.2 61.59,56.2
N$27  (1 unrouted)
  Top 0.254: C20.1 R10.1
N$28
  Top 0.254: U1.57 85.93,43.45 87.47,41.91 87.47,41.51 R3.2
N$29  (via drill 0.5)
  Top 0.254: U1.19 70.71,45.94 v70.96,45.72 | v70.96,47.15 70.48,47.47 69.53,47.47 68.42,48.58 40.64,48.58 33.02,59.67 | U2.5 33.02,59.67 | U2.3 33.02,60.98 33.02,59.67
  Bottom 0.254: v70.96,45.72 v70.96,47.15
N$30
  Top 0.254: U1.13 72.71,50.32 71.28,51.75 43.81,51.75 40.01,61.64 U2.13
N$31  (1 unrouted)
N$32  (1 unrouted)
N$33
  Top 0.254: X9.6 R7.2 88.9,8.04 88.9,11.75 87.63,11.75 R12.2
N$34  (1 unrouted)
N$35  (1 unrouted)
  Top 0.254: U1.23 63.66,43.96
N$36
  Top 1.016: SK5A.6 X6.1
N$37
  Top 1.016: SK2A.3 X16.4
N$38
  Top 1.016: SK2A.4 X16.3
N$39
  Top 1.016: SK2A.5 X16.2
N$40  (1 unrouted)
  Top 0.254: SK1B.9 24.13,20.8 25.55,22.23 46.99,22.23 | SK2B.9 46.99,22.23 | 46.99,22.23 69.85,22.23 SK3B.9 | U1.25 68.5,42.95 67.94,42.39 67.94,41.27 67.31,40.64 67.31,33.02
N$41
  Top 0.254: U1.42 75.73,36.53 74.2,35 74.2,27.7
N$42
  Top 0.254: U1.52 81.46,40.94 82.2,40.2 82.48,40.2 83.2,39.48 83.2,37.95 87.51,33.64
N$43
  Top 1.016: SK2A.6 X16.1
N$44  (1 unrouted)
  Top 0.254: SK5B.3 45.09,45.09 59.05,45.09
N$45
  Top 0.254: X8.3 X7.3 JP15.3 R1.1
N$46  (via drill 0.6)
  other vias: 33.02,39.37
N$47  (3 unrouted)
  Top 0.254: X100.GND4 X100.GND5 X100.GND6 X100.GND1
N$48  (1 unrouted)
  Top 0.254: SK4B.9 35.56,43.48 37.8,45.72 59.69,45.72 | U1.33 71.21,36.76 70.64,36.2 60.96,36.2
N$49
  Top 1.27: X101.5 7.19,51.01 C17.1
  Top 3.81: X101.4 6.19,44.93 | 6.19,49.21 5.89,49.51 X101.5
  Top 4.318: 6.19,44.93 6.19,49.21
N$50  (1 unrouted)
  Top 0.254: C19.1 R11.1
N$51  (1 unrouted)
  Top 0.254: SK4B.1 17.78,40.64 38.1,40.64 | SK5B.1 38.1,40.64 | 38.1,40.64 60.96,40.64 | U1.63 81.48,46.45 81.76,46.72 81.76,48.26 82.07,48.26 82.07,57.31 67.31,57.31
N$52  (via drill 0.6)  (2 unrouted)
  Top 0.254: SK1B.1 6.35,17.78 26.67,17.78 | SK2B.1 26.67,17.78 | 26.67,17.78 v49.53,17.78 74.93,17.78 | 81.44,44.45 81.92,44.45 82.87,45.4 86.36,45.4 88.58,43.18 88.58,35.88
  Bottom 0.254: SK3B.1 v49.53,17.78
N$53  (1 unrouted)
  Top 0.254: R7.1 R8.1 R9.1 86.36,9.74 86.36,12.7 88.9,12.7
N$54  (via drill 0.5)  (1 unrouted)
  Top 0.254: U1.49 v82.16,39.44 | 86.53,37.42 v84.5,39.45 | 60.96,46.99 35.5,46.99 33.6,45.09 22.23,45.09 SK4B.3
  Bottom 0.254: v82.16,39.44 v84.5,39.45
N$55
  Top 0.254: X9.4 R8.2 85.09,8.1 84.14,8.1 84.14,8.89 81.28,8.89 81.28,10.79 85.09,10.79 R11.2
N$56  (1 unrouted)
N$57  (1 unrouted)
  Top 0.254: SK3B.3 55.88,19.05 72.39,19.05 72.39,24.13 | U1.6 76.22,50.34 77.15,51.28 77.15,55.24 62.23,55.24 62.23,52.07
N$58  (1 unrouted)
  Top 0.254: SK2B.3 31.75,19.05 47.62,19.05 48.26,19.68 48.26,21.59 68.58,21.59 | U1.5 76.72,50.21 78.26,51.75 78.26,55.72 69.22,55.72
N$59  (1 unrouted)
N$60
  Top 0.61: Q4.3 X1.1
N$61  (via drill 0.6)
  other vias: 27.94,39.37
N$62  (1 unrouted)
  Top 0.254: U1.31 68.52,39.95 68.26,39.69 68.26,32.86
N$63  (1 unrouted)
N$65  (via drill 0.6)
  Top 0.254: v25.08,50.96 28.89,54.77 R4.1
  Top 0.508: v17.14,50.96 16.99,50.95 Q1.1
  Bottom 0.254: v17.14,50.96 v25.08,50.96
N$66  (via drill 0.6)
  Top 0.254: v22.86,66.52 22.86,63.93 Q2.1 | R5.1 28.89,66.52 v28.57,66.52
  Bottom 0.254: v22.86,66.52 v28.57,66.52
N$67  (via drill 0.6)
  Top 0.254: Q3.1 23.5,72.03 v23.5,73.98 | v28.42,71.91 28.89,71.44 R6.1
  Bottom 0.254: v23.5,73.98 26.35,73.98 v28.42,71.91
N$68
  Top 0.254: X9.2 R9.2 82.55,7.94 80.64,7.94 80.64,11.85 R10.2
N$69  (1 unrouted)
  Top 0.254: R12.1 C15.1
N$70
  Top 0.254: U1.16 71.21,50.55 41.27,50.55 33.66,62.24 U2.1
N$71
  Top 0.254: R6.2 29.05,68.58 36.66,60.98 U2.12
N$72
  Top 0.254: R4.2 28.89,58.74 30.8,58.74 30.8,59.02 | 30.8,59.02 U2.6 | U2.4 30.8,60.33 30.8,59.02
N$73
  Top 0.254: U2.2 28.89,61.62 R5.2
N$74  (via drill 0.6)
  other vias: 55.88,39.37
N$75  (via drill 0.6)
  other vias: 53.34,39.37
N$76  (via drill 0.6)
  other vias: 30.48,39.37
N$78
  Top 1.016: D2.C 31.75,74.15 | 31.75,74.15 U4.1 | C21.2 31.75,73.66 31.75,74.15
VCC  (via drill 0.5, 0.6)  (4 unrouted)
  Top 0.254: C9.1 U1.7 75.73,47.62 v76.04,47.31 | 77.47,43.96 U1.58 82.41,43.96 C12.1 | 77.47,43.96 77.47,40.01 77.23,39.77 U1.45 77.19,37.59 C11.1 79.24,34.94 C4.1 | v76.04,45.88 76.04,45.39 77.47,43.96 | v74.45,45.88 73.88,46.45 U1.18 67.03,46.45 C10.1 67.15,46.41 67.15,45.09 62.87,45.09 62.87,39.37 59.69,39.37 | v39.37,16.51 v41.91,16.51 v44.45,16.51 v62.23,16.51 v64.77,16.51 v67.31,16.51 71.12,16.51 71.12,12.7 73.24,12.7 R1.2 | v27.94,39.37 v30.48,39.37 v33.02,39.37 v50.8,39.37 v53.34,39.37 v55.88,39.37 59.69,39.37 | 59.69,29.21 59.69,39.21 59.69,39.37 | 60.96,29.21 62.23,29.21 v62.23,24.13
  Top 0.305: SK1A.2 8.89,8.89 22.86,8.89 22.86,6.35 31.75,6.35 SK2A.2 31.75,8.89 45.72,8.89 45.72,6.35 54.61,6.35 SK3A.2 54.61,8.89 68.58,8.89 68.58,6.35 71.12,6.35 71.12,12.7 | SK4A.2 20.32,31.75 34.29,31.75 34.29,29.21 43.18,29.21 SK5A.2 43.18,31.75 57.15,31.75 57.15,29.21 59.69,29.21 60.96,29.21 | v16.51,16.51 v19.05,16.51 v21.59,16.51 v39.37,16.51
  Bottom 0.254: v76.04,47.31 v76.04,45.88 v74.45,45.88 | v62.23,16.51 SK3B.6 v62.23,24.13 | SK1B.8 v21.59,16.51 | SK2B.8 v44.45,16.51 | SK4B.6 v27.94,39.37 | v30.48,39.37 SK4B.7 | SK4B.8 v33.02,39.37 | SK5B.7 v53.34,39.37 | SK5B.8 v55.88,39.37 | SK5B.6 v50.8,39.37 | SK1B.7 v19.05,16.51 | SK2B.7 v41.91,16.51 | SK3B.8 v67.31,16.51 | SK3B.7 v64.77,16.51
  Bottom 0.305: SK1B.6 v16.51,16.51 | v39.37,16.51 SK2B.6
VCC5  (3 unrouted)
  Top 0.254: U4.3 41.91,72.09 37.53,63.77 U2.14
  Top 1.016: C14.2 38.03,75.64 U4.3
  pour Top: 51.32,66.6 60.22,66.5 60.22,63.27 51.32,63.37
VDDCORE  (via drill 0.5)  (1 unrouted)
  Top 0.254: U1.64 81.02,46.96 C8.1 | 73.65,50.3 73.2,49.85 73.2,48.81 U1.12 | C7.1 82.31,41.95 U1.54 v79.15,41.95 | C6.1 67.83,43.45 U1.24 75.22,43.45 | U1.64 80.58,47 79.3,47 79.3,46.96 | U1.64 79.3,46.96 | 79.3,46.96 78.94,46.6 75.22,46.6 | v76.65,41.95 75.25,43.4 75.22,43.43 75.22,43.45 | 73.65,50.3 74.7,50.3 75.2,49.8 75.2,48.81 U1.8 75.22,46.6 | C5.1 73.65,51.44 | 73.65,51.44 73.65,50.3 | 73.65,51.44 72.76,51.44 71.6,52.6 | 75.22,46.6 75.22,43.45
  Bottom 0.254: v76.65,41.95 v79.15,41.95
X6  (1 unrouted)
  Top 0.254: U1.32 69.36,30.34 69.37,30.32

### Text on the board
tNames: Erase | Reset
bNames: 3D Printer Controller v1.0 / Designed by Escher Technologies Ltd. / www.eschertech.com